# Altium schematic sheet WX0.012.616DL.SchDoc
size A2
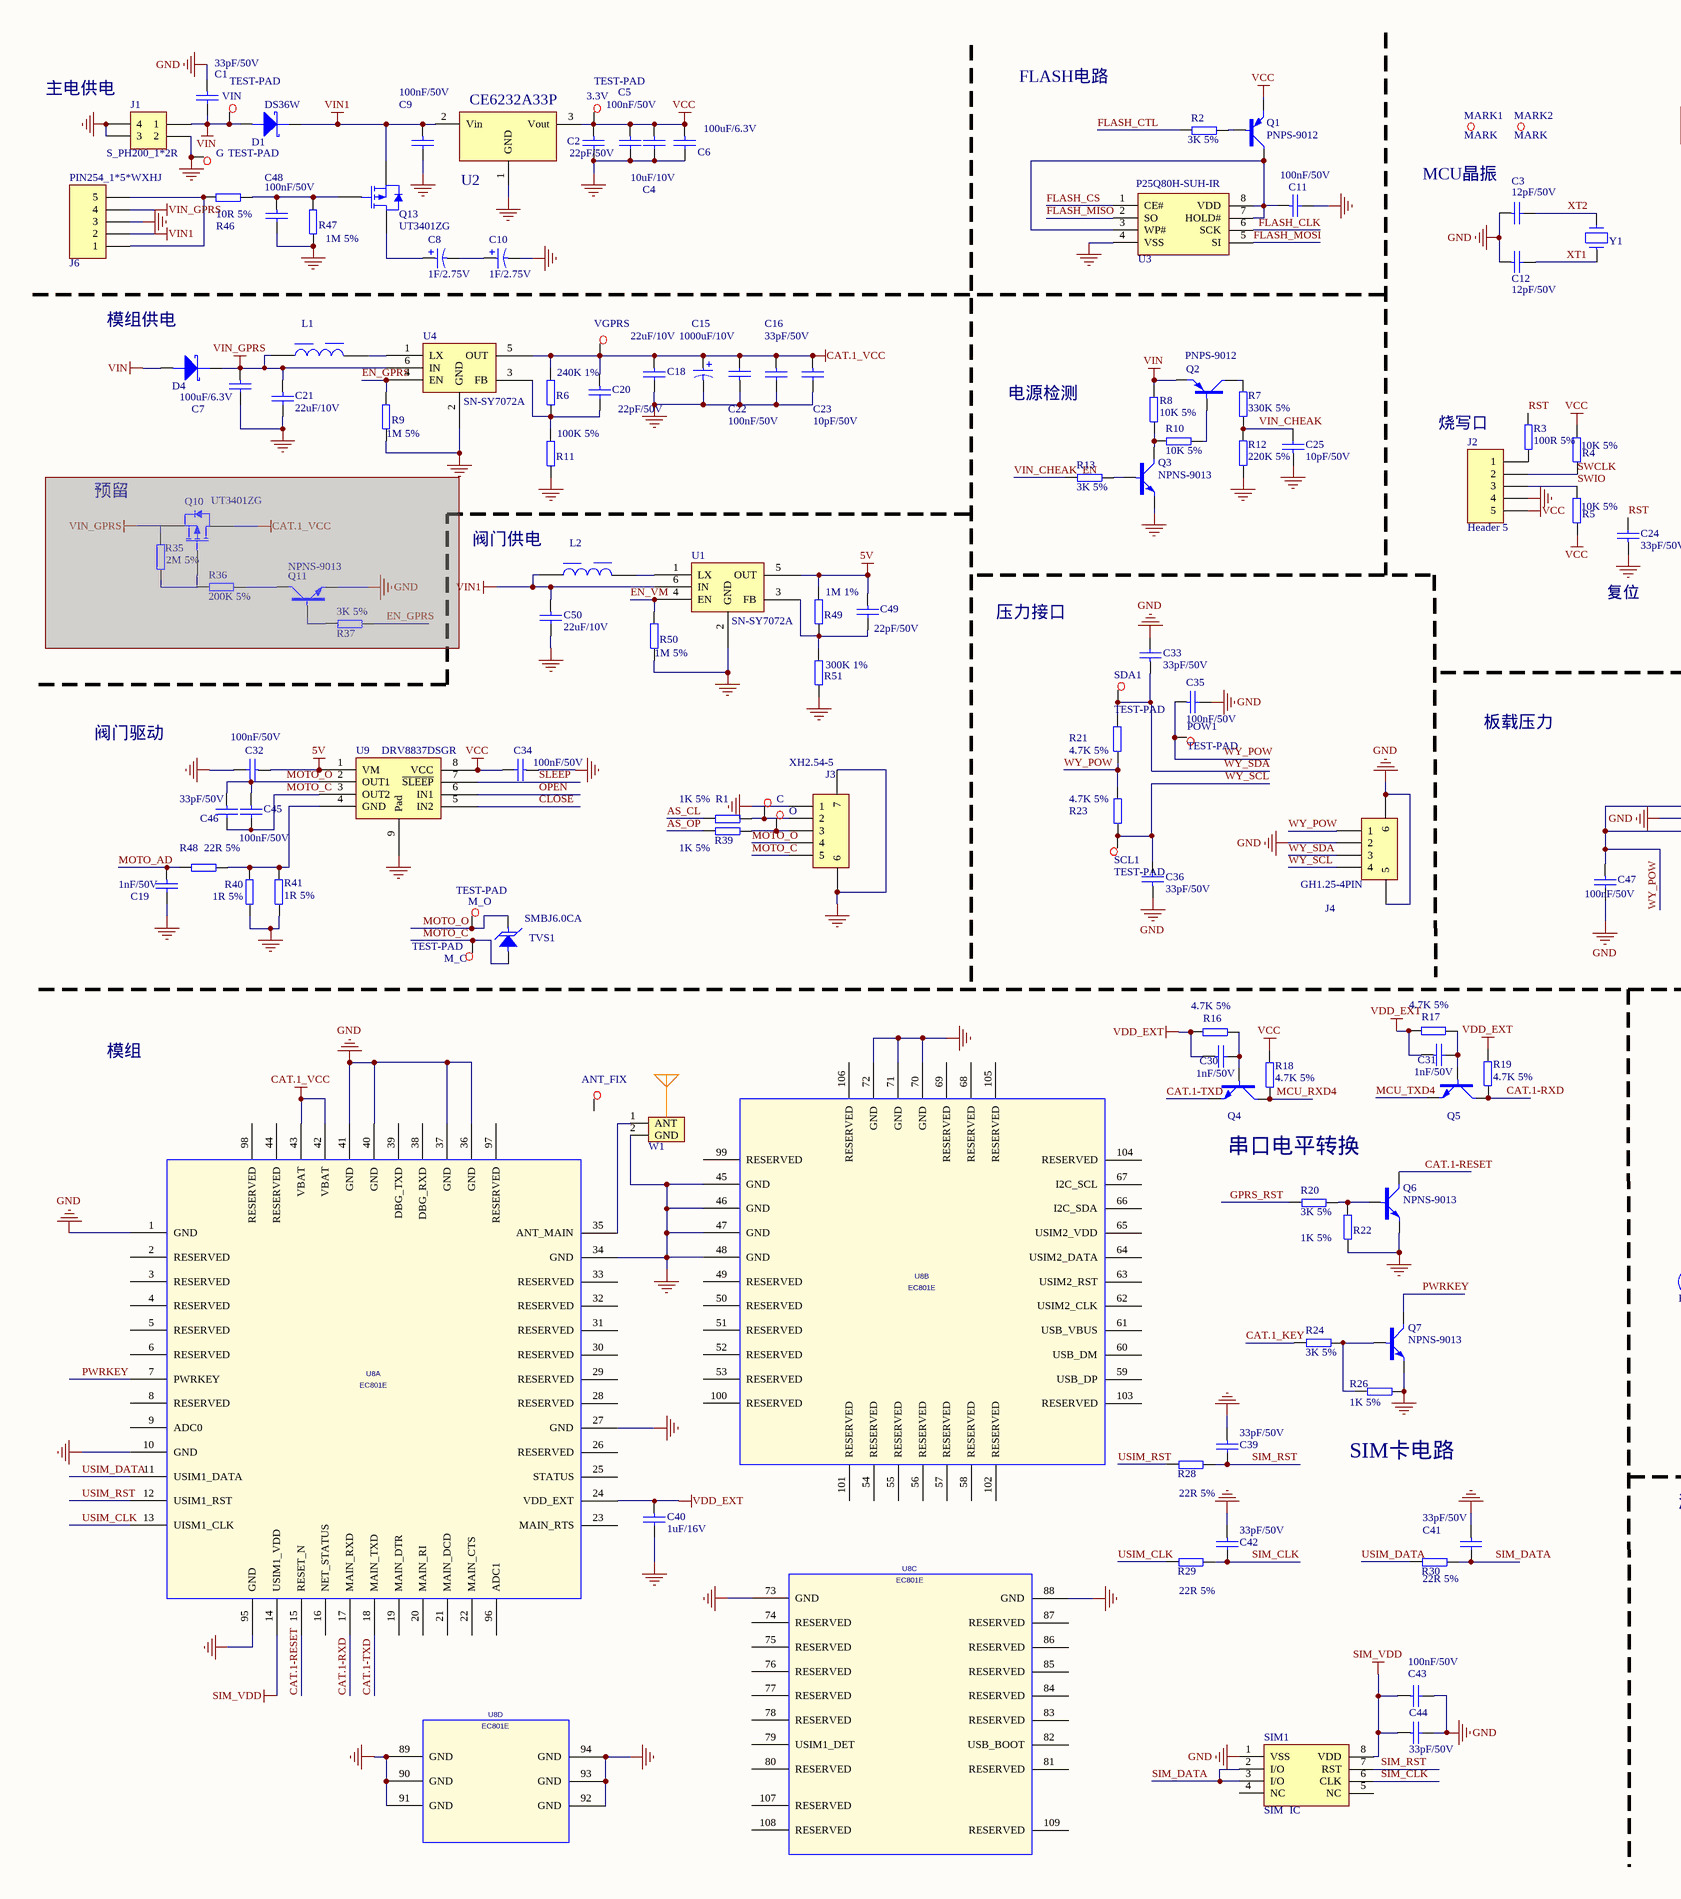
[diagram p0: WX0.012.616DL.SchDoc, left]
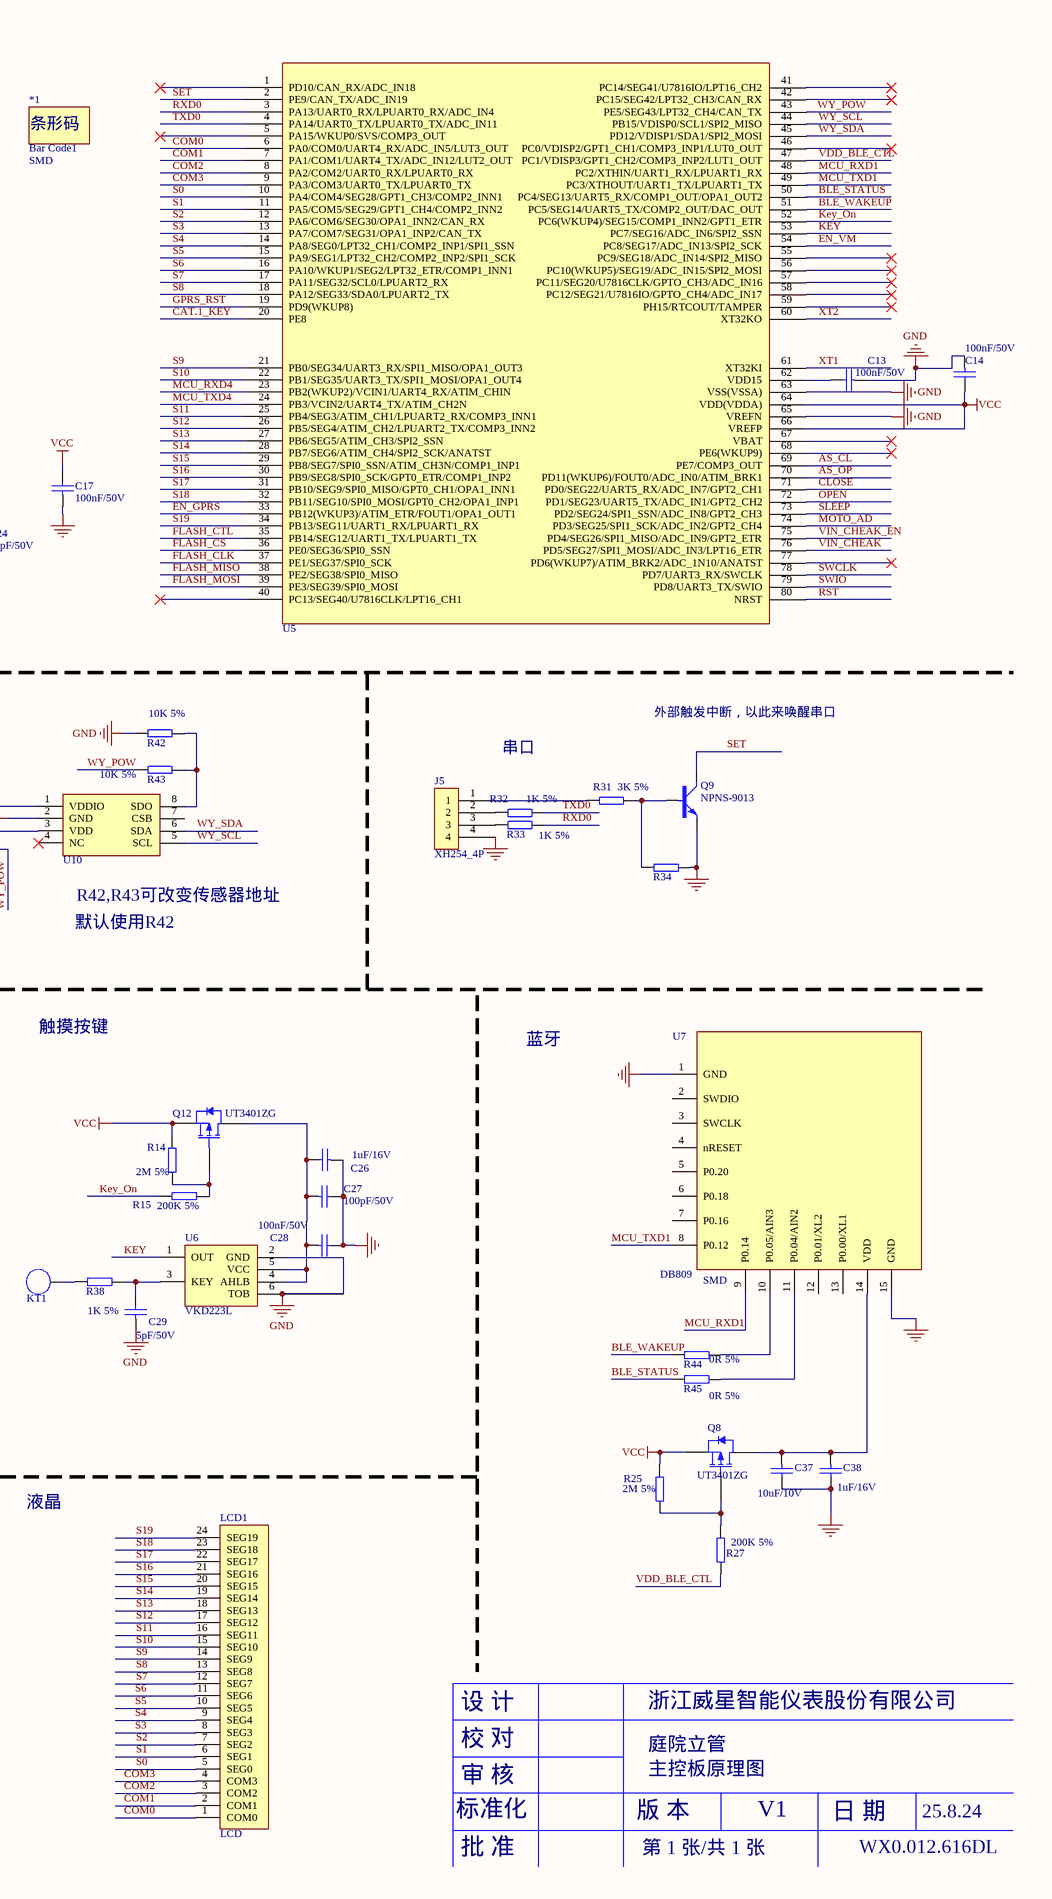
[diagram p1: WX0.012.616DL.SchDoc, right]

## Parts
3.3V  TEST-PAD  [TEST-PAD]
*1  Bar Code1  SMD/DIP: SMD  [Bar Code1]
ANT_FIX  天线固定脚  [ANT-fix]  (value not drawn)
C  TEST-PAD  [TEST-PAD]  (value not drawn)
C1  33pF/50V  [CAP0603]
C2  22pF/50V  [CAP0603]
C3  12pF/50V  [CAP0603]
C4  10uF/10V  [CAP0603]
C5  100nF/50V  [CAP0603]
C6  100uF/6.3V  [GRM1206]
C7  100uF/6.3V  [GRM1206]
C8  1F/2.75V  [CAPPC_350_800_1600]
C9  100nF/50V  [CAP0603]
C10  1F/2.75V  [CAPPC_350_800_1600]
C11  100nF/50V  [CAP0603]
C12  12pF/50V  [CAP0603]
C13  100nF/50V  [CAP0603]
C14  100nF/50V  [CAP0603]
C15  1000uF/10V  [CAPSM_400_1000_1050]
C16  33pF/50V  [CAP0603]
C17  100nF/50V  [CAP0603]
C18  22uF/10V  [CAP0805]
C19  1nF/50V  [CAP0603]
C20  22pF/50V  [CAP0603]
C21  22uF/10V  [CAP0805]
C22  100nF/50V  [CAP0603]
C23  10pF/50V  [CAP0603]
C24  33pF/50V  [CAP0603]
C25  10pF/50V  [CAP0603]
C26  1uF/16V  [CAP0603]
C27  100pF/50V  [CAP0603]
C28  100nF/50V  [CAP0603]
C29  5pF/50V  [CAP0603]
C30  1nF/50V  [CAP0603]
C31  1nF/50V  [CAP0603]
C32  100nF/50V  [CAP0603]
C33  33pF/50V  [CAP0603]
C34  100nF/50V  [CAP0603]
C35  100nF/50V  [CAP0603]
C36  33pF/50V  [CAP0603]
C37  10uF/10V  [CAP0603]
C38  1uF/16V  [CAP0603]
C39  33pF/50V  [CAP0603]
C40  1uF/16V  [CAP0603]
C41  33pF/50V  [CAP0603]
C42  33pF/50V  [CAP0603]
C43  100nF/50V  [CAP0603]
C44  33pF/50V  [CAP0603]
C45  100nF/50V  [CAP0603]
C46  33pF/50V  [CAP0603]
C47  100nF/50V  [CAP0603]
C48  100nF/50V  [CAP0603]
C49  22pF/50V  [CAP0603]
C50  22uF/10V  [CAP0805]
D1  DS36W  [SOD-123FL]
D4  DS36W  [SOD-123FL]  (value not drawn)
G  TEST-PAD  [TEST-PAD]
J1  S_PH200_1*2R  [CONN-SMD_2.0-2PLT]
J2  Header 5  [PIN254_1*5SR]
J3  XH2.54-5  [CONN-SMD_5P-P2.50_ZX-XH2.54-5PLT]
J4  GH1.25-4PIN  [CONN-SMD_4P-P1.25_XUNPU_WAFER-GH1.25-4PLB]
J5  XH254_4P  [HDR1X4_2.54]
J6  PIN254_1*5*WXHJ  [PIN254_1*5*1100S]
KT1  Touch  [TOUCH-0.3-7-8]  (value not drawn)
L1  4.7uH  [IND4020]  (value not drawn)
L2  4.7uH  [IND4020]  (value not drawn)
LCD1  LCD  [GVH31158A-HPP-WG]
M_C  TEST-PAD  [TEST-PAD]
M_O  TEST-PAD  [TEST-PAD]
MARK1  MARK  [MARK]
MARK2  MARK  [MARK]
O  TEST-PAD  [TEST-PAD]  (value not drawn)
POW1  TEST-PAD  [TEST-PAD]
Q1  PNPS-9012  [SOT-23]
Q2  PNPS-9012  [SOT-23]
Q3  NPNS-9013  [SOT-23]
Q4  NPNS-9013  [SOT-23]  (value not drawn)
Q5  NPNS-9013  [SOT-23]  (value not drawn)
Q6  NPNS-9013  [SOT-23]
Q7  NPNS-9013  [SOT-23]
Q8  UT3401ZG  [SOT-23]
Q9  NPNS-9013  [SOT-23]
Q10  UT3401ZG  [SOT-23]  (masked out: inside a compile mask, not in the netlist)
Q11  NPNS-9013  [SOT-23]  (masked out: inside a compile mask, not in the netlist)
Q12  UT3401ZG  [SOT-23]
Q13  UT3401ZG  [SOT-23]
R1  1K 5%  [RES0603]
R2  3K 5%  [RES0603]
R3  100R 5%  [RES0603]
R4  10K 5%  [RES0603]
R5  10K 5%  [RES0603]
R6  240K 1%  [RES0603]
R7  330K 5%  [RES0603]
R8  10K 5%  [RES0603]
R9  1M 5%  [RES0603]
R10  10K 5%  [RES0603]
R11  100K 5%  [RES0603]
R12  220K 5%  [RES0603]
R13  3K 5%  [RES0603]
R14  2M 5%  [RES0603]
R15  200K 5%  [RES0603]
R16  4.7K 5%  [RES0603]
R17  4.7K 5%  [RES0603]
R18  4.7K 5%  [RES0603]
R19  4.7K 5%  [RES0603]
R20  3K 5%  [RES0603]
R21  4.7K 5%  [RES0603]
R22  1K 5%  [RES0603]
R23  4.7K 5%  [RES0603]
R24  3K 5%  [RES0603]
R25  2M 5%  [RES0603]
R26  1K 5%  [RES0603]
R27  200K 5%  [RES0603]
R28  22R 5%  [RES0603]
R29  22R 5%  [RES0603]
R30  22R 5%  [RES0603]
R31  3K 5%  [RES0603]
R32  1K 5%  [RES0603]
R33  1K 5%  [RES0603]
R34  1K 5%  [RES0603]  (value not drawn)
R35  2M 5%  [RES0603]  (masked out: inside a compile mask, not in the netlist)
R36  200K 5%  [RES0603]  (masked out: inside a compile mask, not in the netlist)
R37  3K 5%  [RES0603]  (masked out: inside a compile mask, not in the netlist)
R38  1K 5%  [RES0603]
R39  1K 5%  [RES0603]
R40  1R 5%  [RES1206]
R41  1R 5%  [RES1206]
R42  10K 5%  [RES0603]
R43  10K 5%  [RES0603]
R44  0R 5%  [RES0603]
R45  0R 5%  [RES0603]
R46  10R 5%  [RES0603]
R47  1M 5%  [RES0603]
R48  22R 5%  [RES0603]
R49  1M 1%  [RES0603]
R50  1M 5%  [RES0603]
R51  300K 1%  [RES0603]
SCL1  TEST-PAD  [TEST-PAD]
SDA1  TEST-PAD  [TEST-PAD]
SIM1  SIM  IC  [SIMIC]
TVS1  SMBJ6.0CA  [DO-214AA]
U1  SN-SY7072A  [SOT-23-6]
U2  CE6232A33P  [SOT-89]
U3  P25Q80H-SUH-IR  [SOP-8L-200MIL]
U4  SN-SY7072A  [SOT-23-6]
U5  FM33LG048  [LQFP80]  (value not drawn)
U6  VKD223L  [SOT-23-6]
U7  DB809  SMD/DIP: SMD  [DB809]
U8  EC801E  [EC801E]  (parts A,B,C,D of 4)
U9  DRV8837DSGR  [S-PWSON-N8]
U10  07_HP303B  [HP303B]  (value not drawn)
VGPRS  TEST-PAD  [TEST-PAD]  (value not drawn)
VIN  TEST-PAD  [TEST-PAD]
W1  天线  [ANT-tanpian]  (value not drawn)
Y1  SF32WK32768D71T005  [SMD-3215_2P]  (value not drawn)

## Nets
5V: C32.1 C49.1 R49.2 U1.5(OUT) U9.1(VM)
CAT.1_VCC: C15.1 C16.1 C18.1 C20.1 C22.2 C23.1 R6.2 U4.5(OUT) U8.42(VBAT) U8.43(VBAT) VGPRS.1
GND: C1.1 C2.2 C3.1 C4.2 C5.2 C6.2 C7.2 C9.2 C10.2 C11.2 C12.1 C13.1 C14.1 C15.2 C16.2 C17.1 C18.2 C19.2 C21.2 C22.1 C23.2 C24.1 C25.1 C26.1 C27.2 C28.2 C29.1 C32.2 C33.2 C34.1 C35.2 C36.1 C37.2 C38.2 C39.1 C40.2 C41.1 C42.1 C43.2 C44.2 C47.2 C48.2 C50.2 G.1 J1.2 J1.3 J1.4 J2.4 J3.1 J3.6 J3.7 J4.2 J4.5 J4.6 J5.4 J6.3 Q3.2(E) Q6.2(E) Q7.2(E) Q9.2(E) R9.1 R11.1 R12.2 R22.1 R26.2 R34.2 R40.1 R41.1 R42.2 R47.1 R50.1 R51.1 SIM1.1(VSS) U1.2(GND) U2.1(GND) U3.4(VSS) U4.2(GND) U5.63(VSS(VSSA)) U5.65(VREFN) U6.2(GND) U6.6(TOB) U7.1(GND) U7.15(GND) U8.1(GND) U8.10(GND) U8.27(GND) U8.34(GND) U8.36(GND) U8.37(GND) U8.40(GND) U8.41(GND) U8.45(GND) U8.46(GND) U8.47(GND) U8.48(GND) U8.70(GND) U8.71(GND) U8.72(GND) U8.73(GND) U8.88(GND) U8.89(GND) U8.90(GND) U8.91(GND) U8.92(GND) U8.93(GND) U8.94(GND) U8.95(GND) U9.9(Pad) U10.2(GND) W1.2(GND)
SIM_VDD: C43.1 C44.1 SIM1.8(VDD) U8.14(USIM1_VDD)
VCC: 3.3V.1 C2.1 C4.1 C5.1 C6.1 C14.2 C17.2 C34.2 J2.5 Q1.2(E) Q8.2(S) Q12.2(S) R4.2 R5.1 R14.2 R18.2 R25.2 U2.3(Vout) U5.64(VDD(VDDA)) U5.66(VREFP) U9.8(VCC)
VDD_EXT: C30.1 C31.1 C40.1 R16.1 R17.1 R19.2 U8.24(VDD_EXT)
VIN: C1.2 D1.1 D4.1 J1.1 Q2.2(E) R8.2 VIN.1
VIN1: C9.1 C50.1 D1.2 J6.2 L2.1 Q13.2(S) U1.6(IN) U2.2(Vin)
VIN_GPRS: C7.1 C21.1 D4.2 J6.4 L1.1 U4.6(IN)
AS_CL: R1.1 U5.69(PE7/COMP3_OUT)
AS_OP: R39.1 U5.70(PD11(WKUP6)/FOUT0/ADC_IN0/ATIM_BRK1)
BLE_STATUS: R45.1 U5.50(PC4/SEG13/UART5_RX/COMP1_OUT/OPA1_OUT2)
BLE_WAKEUP: R44.1 U5.51(PC5/SEG14/UART5_TX/COMP2_OUT/DAC_OUT)
CAT.1-RESET: Q6.3(C) U8.15(RESET_N)
CAT.1-RXD: Q5.3(C) R19.1 U8.17(MAIN_RXD)
CAT.1-TXD: Q4.2(E) U8.18(MAIN_TXD)
CAT.1_KEY: R24.1 U5.20(PE8)
CLOSE: U5.71(PD0/SEG22/UART5_RX/ADC_IN7/GPT2_CH1) U9.5(IN2)
COM0: LCD1.1(COM0) U5.6(PA0/COM0/UART4_RX/ADC_IN5/LUT3_OUT)
COM1: LCD1.2(COM1) U5.7(PA1/COM1/UART4_TX/ADC_IN12/LUT2_OUT)
COM2: LCD1.3(COM2) U5.8(PA2/COM2/UART0_RX/LPUART0_RX)
COM3: LCD1.4(COM3) U5.9(PA3/COM3/UART0_TX/LPUART0_TX)
EN_GPRS: R9.2 U4.4(EN) U5.33(PB12(WKUP3)/ATIM_ETR/FOUT1/OPA1_OUT1)
EN_VM: R50.2 U1.4(EN) U5.54(PC8/SEG17/ADC_IN13/SPI2_SCK)
FLASH_CLK: U3.6(SCK) U5.37(PE1/SEG37/SPI0_SCK)
FLASH_CS: U3.1(CE#) U5.36(PE0/SEG36/SPI0_SSN)
FLASH_CTL: R2.1 U5.35(PB14/SEG12/UART1_TX/LPUART1_TX)
FLASH_MISO: U3.2(SO) U5.38(PE2/SEG38/SPI0_MISO)
FLASH_MOSI: U3.5(SI) U5.39(PE3/SEG39/SPI0_MOSI)
GPRS_RST: R20.1 U5.19(PD9(WKUP8))
KEY: U5.53(PC7/SEG16/ADC_IN6/SPI2_SSN) U6.1(OUT)
Key_On: R15.2 U5.52(PC6(WKUP4)/SEG15/COMP1_INN2/GPT1_ETR)
MCU_RXD1: U5.48(PC2/XTHIN/UART1_RX/LPUART1_RX) U7.9(P0.14)
MCU_RXD4: Q4.3(C) R18.1 U5.23(PB2(WKUP2)/VCIN1/UART4_RX/ATIM_CHIN)
MCU_TXD1: U5.49(PC3/XTHOUT/UART1_TX/LPUART1_TX) U7.8(P0.12)
MCU_TXD4: Q5.2(E) U5.24(PB3/VCIN2/UART4_TX/ATIM_CH2N)
MOTO_AD: C19.1 R48.1 U5.74(PD3/SEG25/SPI1_SCK/ADC_IN2/GPT2_CH4)
MOTO_C: C45.2 C46.2 J3.5 M_C.1 TVS1.1 U9.3(OUT2)
MOTO_O: C45.1 C46.1 J3.4 M_O.1 TVS1.2 U9.2(OUT1)
OPEN: U5.72(PD1/SEG23/UART5_TX/ADC_IN1/GPT2_CH2) U9.6(IN1)
PWRKEY: Q7.3(C) U8.7(PWRKEY)
RST: C24.2 R3.1 U5.80(NRST)
RXD0: R33.2 U5.3(PA13/UART0_RX/LPUART0_RX/ADC_IN4)
S0: LCD1.5(SEG0) U5.10(PA4/COM4/SEG28/GPT1_CH3/COMP2_INN1)
S1: LCD1.6(SEG1) U5.11(PA5/COM5/SEG29/GPT1_CH4/COMP2_INN2)
S2: LCD1.7(SEG2) U5.12(PA6/COM6/SEG30/OPA1_INN2/CAN_RX)
S3: LCD1.8(SEG3) U5.13(PA7/COM7/SEG31/OPA1_INP2/CAN_TX)
S4: LCD1.9(SEG4) U5.14(PA8/SEG0/LPT32_CH1/COMP2_INP1/SPI1_SSN)
S5: LCD1.10(SEG5) U5.15(PA9/SEG1/LPT32_CH2/COMP2_INP2/SPI1_SCK)
S6: LCD1.11(SEG6) U5.16(PA10/WKUP1/SEG2/LPT32_ETR/COMP1_INN1)
S7: LCD1.12(SEG7) U5.17(PA11/SEG32/SCL0/LPUART2_RX)
S8: LCD1.13(SEG8) U5.18(PA12/SEG33/SDA0/LPUART2_TX)
S9: LCD1.14(SEG9) U5.21(PB0/SEG34/UART3_RX/SPI1_MISO/OPA1_OUT3)
S10: LCD1.15(SEG10) U5.22(PB1/SEG35/UART3_TX/SPI1_MOSI/OPA1_OUT4)
S11: LCD1.16(SEG11) U5.25(PB4/SEG3/ATIM_CH1/LPUART2_RX/COMP3_INN1)
S12: LCD1.17(SEG12) U5.26(PB5/SEG4/ATIM_CH2/LPUART2_TX/COMP3_INN2)
S13: LCD1.18(SEG13) U5.27(PB6/SEG5/ATIM_CH3/SPI2_SSN)
S14: LCD1.19(SEG14) U5.28(PB7/SEG6/ATIM_CH4/SPI2_SCK/ANATST)
S15: LCD1.20(SEG15) U5.29(PB8/SEG7/SPI0_SSN/ATIM_CH3N/COMP1_INP1)
S16: LCD1.21(SEG16) U5.30(PB9/SEG8/SPI0_SCK/GPT0_ETR/COMP1_INP2)
S17: LCD1.22(SEG17) U5.31(PB10/SEG9/SPI0_MISO/GPT0_CH1/OPA1_INN1)
S18: LCD1.23(SEG18) U5.32(PB11/SEG10/SPI0_MOSI/GPT0_CH2/OPA1_INP1)
S19: LCD1.24(SEG19) U5.34(PB13/SEG11/UART1_RX/LPUART1_RX)
SET: Q9.3(C) U5.2(PE9/CAN_TX/ADC_IN19)
SIM_CLK: C42.2 R29.2 SIM1.6(CLK)
SIM_DATA: C41.2 R30.2 SIM1.2(I/O) SIM1.3(I/O)
SIM_RST: C39.2 R28.2 SIM1.7(RST)
SLEEP: U5.73(PD2/SEG24/SPI1_SSN/ADC_IN8/GPT2_CH3) U9.7(~{SLEEP})
SWCLK: J2.2 R4.1 U5.78(PD7/UART3_RX/SWCLK)
SWIO: J2.3 R5.2 U5.79(PD8/UART3_TX/SWIO)
TXD0: R32.2 U5.4(PA14/UART0_TX/LPUART0_TX/ADC_IN11)
USIM_CLK: R29.1 U8.13(UISM1_CLK)
USIM_DATA: R30.1 U8.11(USIM1_DATA)
USIM_RST: R28.1 U8.12(USIM1_RST)
VDD_BLE_CTL: R27.1 U5.47(PC1/VDISP3/GPT1_CH2/COMP3_INP2/LUT1_OUT)
VIN_CHEAK: C25.2 R7.2 R12.1 U5.76(PD5/SEG27/SPI1_MOSI/ADC_IN3/LPT16_ETR)
VIN_CHEAK_EN: R13.1 U5.75(PD4/SEG26/SPI1_MISO/ADC_IN9/GPT2_ETR)
WY_POW: C35.1 C47.1 J4.1 POW1.1 R21.1 R23.1 R43.2 U5.43(PE5/SEG43/LPT32_CH4/CAN_TX) U10.1(VDDIO) U10.3(VDD)
WY_SCL: C36.2 J4.4 R23.2 SCL1.1 U5.44(PB15/VDISP0/SCL1/SPI2_MISO) U10.5(SCL)
WY_SDA: C33.1 J4.3 R21.2 SDA1.1 U5.45(PD12/VDISP1/SDA1/SPI2_MOSI) U10.6(SDA)
XT1: C12.2 U5.61(XT32KI) Y1.1
XT2: C3.2 U5.60(XT32KO) Y1.2
NetC8_1: C8.1 Q13.3(D)
NetC8_2: C8.2 C10.1
NetC11_1: C11.1 Q1.3(C) U3.3(WP#) U3.7(HOLD#) U3.8(VDD)
NetC13_2: C13.2 U5.62(VDD15)
NetC20_2: C20.2 R6.1 R11.2 U4.3(FB)
NetC26_2: C26.2 C27.1 C28.1 Q12.3(D) U6.4(AHLB) U6.5(VCC)
NetC29_2: C29.2 R38.2 U6.3(KEY)
NetC30_2: C30.2 Q4.1(B) R16.2
NetC31_2: C31.2 Q5.1(B) R17.2
NetC37_1: C37.1 C38.1 Q8.3(D) U7.14(VDD)
NetC48_1: C48.1 Q13.1(G) R46.2 R47.2
NetC49_2: C49.2 R49.1 R51.2 U1.3(FB)
NetC_1: C.1 J3.2 R1.2
NetJ2_1: J2.1 R3.2
NetJ3_3: J3.3 O.1 R39.2
NetJ5_1: J5.1 R31.1
NetJ5_2: J5.2 R32.1
NetJ5_3: J5.3 R33.1
NetJ6_1: J6.1 J6.5 R46.1
NetKT1_1: KT1.1 R38.1
NetL1_2: L1.2 U4.1(LX)
NetL2_2: L2.2 U1.1(LX)
NetQ1_1: Q1.1(B) R2.2
NetQ2_1: Q2.1(B) R10.2
NetQ2_3: Q2.3(C) R7.1
NetQ3_1: Q3.1(B) R13.2
NetQ3_3: Q3.3(C) R8.1 R10.1
NetQ6_1: Q6.1(B) R20.2 R22.2
NetQ7_1: Q7.1(B) R24.2 R26.1
NetQ8_1: Q8.1(G) R25.1 R27.2
NetQ9_1: Q9.1(B) R31.2 R34.1
NetQ12_1: Q12.1(G) R14.1 R15.1
NetR40_2: R40.2 R41.2 R48.2 U9.4(GND)
NetR42_1: R42.1 R43.1 U10.8(SDO)
NetR44_2: R44.2 U7.10(P0.05/AIN3)
NetR45_2: R45.2 U7.11(P0.04/AIN2)
NetU8_35: U8.35(ANT_MAIN) W1.1(ANT)

Not connected (* = marked no-connect by the designer): ANT_FIX 1; SIM1 4(NC) 5(NC); U5 1(PD10/CAN_RX/ADC_IN18)* 5(PA15/WKUP0/SVS/COMP3_OUT)* 40(PC13/SEG40/U7816CLK/LPT16_CH1)* 41(PC14/SEG41/U7816IO/LPT16_CH2)* 42(PC15/SEG42/LPT32_CH3/CAN_RX)* 46(PC0/VDISP2/GPT1_CH1/COMP3_INP1/LUT0_OUT)* 55(PC9/SEG18/ADC_IN14/SPI2_MISO)* 56(PC10(WKUP5)/SEG19/ADC_IN15/SPI2_MOSI)* 57(PC11/SEG20/U7816CLK/GPTO_CH3/ADC_IN16)* 58(PC12/SEG21/U7816IO/GPTO_CH4/ADC_IN17)* 59(PH15/RTCOUT/TAMPER)* 67(VBAT)* 68(PE6(WKUP9))* 77(PD6(WKUP7)/ATIM_BRK2/ADC_1N10/ANATST)*; U7 2(SWDIO) 3(SWCLK) 4(nRESET) 5(P0.20) 6(P0.18) 7(P0.16) 12(P0.01/XL2) 13(P0.00/XL1); U8 2(RESERVED) 3(RESERVED) 4(RESERVED) 5(RESERVED) 6(RESERVED) 8(RESERVED) 9(ADC0) 16(NET_STATUS) 19(MAIN_DTR) 20(MAIN_RI) 21(MAIN_DCD) 22(MAIN_CTS) 23(MAIN_RTS) 25(STATUS) 26(RESERVED) 28(RESERVED) 29(RESERVED) 30(RESERVED) 31(RESERVED) 32(RESERVED) 33(RESERVED) 38(DBG_RXD) 39(DBG_TXD) 44(RESERVED) 49(RESERVED) 50(RESERVED) 51(RESERVED) 52(RESERVED) 53(RESERVED) 54(RESERVED) 55(RESERVED) 56(RESERVED) 57(RESERVED) 58(RESERVED) 59(USB_DP) 60(USB_DM) 61(USB_VBUS) 62(USIM2_CLK) 63(USIM2_RST) 64(USIM2_DATA) 65(USIM2_VDD) 66(I2C_SDA) 67(I2C_SCL) 68(RESERVED) 69(RESERVED) 74(RESERVED) 75(RESERVED) 76(RESERVED) 77(RESERVED) 78(RESERVED) 79(USIM1_DET) 80(RESERVED) 81(RESERVED) 82(USB_BOOT) 83(RESERVED) 84(RESERVED) 85(RESERVED) 86(RESERVED) 87(RESERVED) 96(ADC1) 97(RESERVED) 98(RESERVED) 99(RESERVED) 100(RESERVED) 101(RESERVED) 102(RESERVED) 103(RESERVED) 104(RESERVED) 105(RESERVED) 106(RESERVED) 107(RESERVED) 108(RESERVED) 109(RESERVED); U10 4(NC)* 7(CSB)

## Notes on the sheet
- 主电供电
- FLASH电路
- MCU晶振
- 模组供电
- 电源检测
- 烧写口
- 预留
- 阀门供电
- (near C24) 复位
- 压力接口
- 外部触发中断，以此来唤醒串口
- 阀门驱动
- 板载压力
- 串口
- (near U10) R42,R43可改变传感器地址
- 默认使用R42
- 模组
- 触摸按键
- 蓝牙
- 串口电平转换
- SIM卡电路
- 液晶
- 设 计
- 校 对
- 浙江威星智能仪表股份有限公司
- 庭院立管
- 标准化
- 审 核
- 主控板原理图
- V1
- 25.8.24
- 批 准
- 版 本
- 第 1 张/共 1 张
- 日 期
- WX0.012.616DL

## Library data of the parts
3.3V C G M_C M_O O POW1 SCL1 SDA1 VGPRS VIN = AD_WXHJ_TEST-PAD_01: 单面焊盘测试点; Part Name: 测试点; ID: 23; SMD/DIP: SMD; Part Number: AD_WXHJ_TEST-PAD_01
*1 = AD_WXHJ_Bar Code_02: 条形码 ,填充，无需焊接器件; ID: 17; Part Number: AD_WXHJ_Bar Code_02; Part Name: 条形码
ANT_FIX = AD_WXHJ_TEST-POINT_01: ID: 24; SMD/DIP: SMD; Part Number: AD_WXHJ_TEST-POINT_01; Part Name: 天线固定脚
C1 C16 C24 C33 C36 C39 C41 C42 C44 C46 = 101020103-0027: 33pF,50 V,±10%,0603,国巨,CC0603KRNPO9BN33; Part Name: 0603贴片电容; ID: 17; SMD/DIP: SMD; Part Number: 101020103-0027
C2 C20 C49 = 101020103-0009: 22pF,50 V,±5%,0603,国巨,CC0603JRNPO9BN22; Part Name: 0603贴片电容; ID: 16; SMD/DIP: SMD; Part Number: 101020103-0009
C3 C12 = 101020103-0005: 12P,50 V,±5%,0603,国巨,CC0603JRNPO9BN12; Part Name: 0603贴片电容; ID: 11; SMD/DIP: SMD; Part Number: 101020103-0005
C4 C37 = 101020103-0026: 106pF,10 V,±10%,0603,村田,GRM188R61A106KE47D; Part Name: 0603贴片电容; ID: 8; SMD/DIP: SMD; Part Number: 101020103-0026
C5 C9 C11 C13 C14 C17 C22 C28 C32 C34 C35 C43 C45 C47 C48 = 101020103-0021: 104pF,50 V,±10%,0603,国巨,CC0603KRX7R9BB104; Part Name: 0603贴片电容; ID: 3; SMD/DIP: SMD; Part Number: 101020103-0021
C6 C7 = 101020101-0020: 100uF,6.3 V,±20%,1206,村田,GRM31CR60J107ME39L; Part Name: 贴片电容; ID: 27; SMD/DIP: SMD; Part Number: 101020101-0020
C8 C10 = 1010202-0015: 1F,2.75 V,-20%~+20%,8mm*16mm,红宝石,2.7 DMC 1 M MY4 8X16; Part Name: 法拉电容; ID: 12; SMD/DIP: DIP; Part Number: 1010202-0015
C15 = 1010203-0033: 1000UF,10 V,±20%,10*10.5mm,广东风华高新技术股份有限公司,8102LBM010MT0001T; Part Name: 贴片电解电容; ID: 24; SMD/DIP: SMD; Part Number: 1010203-0033
C18 C21 C50 = 101020102-0012: 226P,10 V,±20%,0805,村田电子有限公司,GRM21BR61A226ME51L; Part Name: 贴片电容; ID: 20; SMD/DIP: SMD; Part Number: 101020102-0012
C19 C30 C31 = 101020103-0022: 102pF,50 V,±10%,0603,国巨,CC0603KRX7R9BB102; Part Name: 0603贴片电容; ID: 13; SMD/DIP: SMD; Part Number: 101020103-0022
C23 C25 = 101020103-0014: 10pF,50 V,±5%,0603,X7R,国巨,CC0603JRNPO9BN100; Part Name: 0603贴片电容; ID: 7; SMD/DIP: SMD; Part Number: 101020103-0014
C26 C38 C40 = 101020103-0003: 105pF,16 V,±10%,0603,国巨,CC0603KRX7R7BB105; Part Name: 0603贴片电容; ID: 14; SMD/DIP: SMD; Part Number: 101020103-0003
C27 = 101020103-0010: 101pf,50 V,±5%,0603,国巨,CC0603JRNP09BN101; Part Name: 0603贴片电容; ID: 4; SMD/DIP: SMD; Part Number: 101020103-0010
C29 = 101020103-0028: 5P,50 V,±5%,0603,闵达,5P/50V，±5%，0603; Part Name: 0603贴片电容; ID: 28; SMD/DIP: SMD; Part Number: 101020103-0028
D1 D4 = 101040101-0055: DS36W,SOD123-FL,3 A,42 V,60 V,浙江领晨科技有限公司,DS36W; Part Name: 贴片肖特基; ID: 40; SMD/DIP: SMD; Part Number: 101040101-0055
J1 = 1010902-0125: PH2.0_2AWR 卧,贴片卧式,母头,单排,2针2.0mm; Part Name: PH座; ID: 24; SMD/DIP: SMD; Part Number: 1010902-0125
J2 = Header 5: Header, 5-Pin
J4 = GH1.25-4PIN: GH1.25-4PIN,立贴
J5 = 90003: 单排插针，4PIN,间距2.54mm; Part Number: 90003; Part Name: 单排插针; ID: 12
J6 = AD_WXHJ_PinHeader_02: 1*5 ，Φ1.0 ，2.54mm，直脚,无需焊接器件; Part Name: 排针; ID: 17; SMD/DIP: DIP; Part Number: AD_WXHJ_PinHeader_02
KT1 = 2: 长度>6，直径9mm; Part Name: 按键; ID: 2; Part Number: *
L1 L2 = 1010302-0027: 4.7uH,2.9A,±20%,4020,伍尔特电子有限公司,74438356047; Part Name: 贴片电感; ID: 43; SMD/DIP: SMD; Part Number: 1010302-0027
LCD1 = GVH31158A
MARK1 MARK2 = AD_WXHJ_MARK_01: MARK点; ID: 8; SMD/DIP: SMD; Part Number: AD_WXHJ_MARK_01; Part Name: MARK点
Q1 Q2 = 101040201-0001: 9012,PNP,SOT-23,JCET;长电,S9012; Part Name: 贴片三极管; ID: 16; SMD/DIP: SMD; Part Number: 101040201-0001
Q3 Q6 Q7 Q9 = 101040201-0002: 9013,NPN,SOT-23,长电,S9013; Part Name: 贴片三极管; ID: 14; SMD/DIP: SMD; Part Number: 101040201-0002
Q4 Q5 Q11 = 101040201-0002: 9013,NPN,SOT-23,长电,S9013; Part Name: 贴片三极管; ID: 15; SMD/DIP: SMD; Part Number: 101040201-0002
Q8 Q10 Q12 Q13 = 101040201-0013: UT3401ZG,P-MOS,SOT-23,UTC,UT3401ZG; Part Name: 功率MOS管; ID: 18; SMD/DIP: SMD; Part Number: 101040201-0013
R1 R22 R26 R32-R34 R38 R39 = 101010103-0008: 1K,±5%,1/10W,0603,国巨,RC0603JR-071KL; Part Name: 0603贴片电阻; ID: 10; SMD/DIP: SMD; Part Number: 101010103-0008
R2 R20 = 101010103-0006: 国巨,±5%,0603,,155 ℃,-55 ℃,RC0603JR-073KL,无铅,100 ppm/℃,1/10W,,3K; Part Name: 0603贴片电阻; ID: 22; SMD/DIP: SMD; Part Number: 101010103-0006
R3 = 101010103-0022: 100R,±5%,1/10W,0603,国巨,RC0603JR-07100RL; Part Name: 0603贴片电阻; ID: 5; SMD/DIP: SMD; Part Number: 101010103-0022
R4 R5 R8 R10 R42 R43 = 101010103-0003: 国巨,±5%,0603,,155 ℃,-55 ℃,RC0603JR-0710KL,无铅,200 ppm/℃,1/10W,,10K; Part Name: 0603贴片电阻; ID: 7; SMD/DIP: SMD; Part Number: 101010103-0003
R6 R11 = 101010103-0005: 国巨,±5%,0603,,155 ℃,-55 ℃,RC0603JR-07100KL,无铅,100 ppm/℃,1/10W,,100K; Part Name: 0603贴片电阻; ID: 3; SMD/DIP: SMD; Part Number: 101010103-0005
R7 = 101010103-0066: 330K,±5%,1/10W,0603,国巨,RC0603JR-07330KL; Part Name: 0603贴片电阻; ID: 30; SMD/DIP: SMD; Part Number: 101010103-0066
R9 R47 R50 = 101010103-0002: 国巨,±5%,0603,,155 ℃,-55 ℃,RC0603JR-071ML,无铅,200 ppm/℃,1/10W,,1M; Part Name: 0603贴片电阻; ID: 11; SMD/DIP: SMD; Part Number: 101010103-0002
R12 = 101010103-0044: 220K,±5%,1/10W,0603,国巨,RC0603JR-07220KL; Part Name: 0603贴片电阻; ID: 31; SMD/DIP: SMD; Part Number: 101010103-0044
R13 R37 = 101010103-0006: 国巨,±5%,0603,,155 ℃,-55 ℃,RC0603JR-073KL,无铅,100 ppm/℃,1/10W,,3K; Part Name: 0603贴片电阻; ID: 23; SMD/DIP: SMD; Part Number: 101010103-0006
R14 R25 R35 = 101010103-0025: 国巨,±5%,0603,,155 ℃,-55 ℃,RC0603JR-072ML,含铅,100 ppm/℃,1/10W,,2M; Part Name: 0603贴片电阻; ID: 20; SMD/DIP: SMD; Part Number: 101010103-0025
R15 R27 R36 = 101010103-0034: 200K,±5%,1/10W,0603,国巨,RC0603JR-07200KL; Part Name: 0603贴片电阻; ID: 13; SMD/DIP: SMD; Part Number: 101010103-0034
R16-R19 R21 R23 = 101010103-0042: 4.7K±5%,1/10W,0603; Part Name: 0603贴片电阻; ID: 24; SMD/DIP: SMD; Part Number: 101010103-0042
R24 R31 = 101010103-0006: 3K±5%,1/10W,0603; Part Name: 0603贴片电阻; ID: 56; Part Number: 101010103-0006
R28-R30 R48 = 101010103-0009: 国巨,±5%,0603,,155 ℃,-55 ℃,RC0603JR-0722RL,无铅,200 ppm/℃,1/10W,,22欧; Part Name: 0603贴片电阻; ID: 18; SMD/DIP: SMD; Part Number: 101010103-0009
R40 R41 = 101010101-0015: 1R±5%,1/4W,1206; Part Name: 1206贴片电阻; ID: 115; Part Number: 101010101-0015
R44 R45 = 101010103-0001: 国巨,±5%,0603,,155 ℃,-55 ℃,RC0603J2-070RL,无铅,200 ppm/℃,1/10W,,0R; Part Name: 0603贴片电阻; ID: 1; SMD/DIP: SMD; Part Number: 101010103-0001
R46 = 101010103-0017: 10R,±5%,1/10W,0603,国巨,RC0603JR-0710RL; Part Name: 0603贴片电阻; ID: 8; SMD/DIP: SMD; Part Number: 101010103-0017
R49 = 101010103-0040: 国巨,±1%,0603,,155 ℃,-55 ℃,RC0603FR-071ML,无铅,100 ppm/℃,1/10W,,1M; Part Name: 0603贴片电阻; ID: 36; SMD/DIP: SMD; Part Number: 101010103-0040
R51 = 101010103-0078: 300K,±1%,1/10W,0603,国巨股份有限公司,RC0603FR-07300KL; Part Name: 0603贴片电阻; ID: 37; SMD/DIP: SMD; Part Number: 101010103-0078
SIM1 = SIMCARD_1
TVS1 = 101040101-0024: SMBJ6.0CA,DO-214AA,10.3 V,6.0 V,600 W,58.3 A,800 uA,上海君耀电子有限公司,SMBJ6.0CA; Part Name: TVS管; ID: 23; SMD/DIP: SMD; Part Number: 101040101-0024
U1 U4 = 1010503-0023: SN-SY7072A,SN-SY7072A,SOT23-6,5.5 V,0.85 V,-0.95 V,5 V,2A,5 uA,矽力杰股份有限公司; Part Name: 贴片芯片; ID: 32; SMD/DIP: SMD; Part Number: 1010503-0023
U2 = 1010503-0029: CE6232-3.3,CE6232-3.3,SOT89-3,8V,1.8V,0.11V,3.3V,300mA,0.8uA,南京芯力微电子有限公司; Part Name: 线性稳压芯片; ID: 5; SMD/DIP: SMD; Part Number: 1010503-0029
U3 = 101050101-0218: P25Q80H-SUH-IR,SOP8208mil,普冉半导体（上海）股份有限公司,P25Q80H-SUH-IR; Part Name: 贴片存储芯片FLASH; ID: 35; SMD/DIP: SMD; Part Number: 101050101-0218
U5 = 101050101-0261: 1.65V-5.5V,LQFP80,上海复旦微电子集团股份有限公司,FM33LG048; Part Name: MCU处理器; ID: 42; SMD/DIP: SMD; Part Number: 101050101-0261
U7 = 1011402-0194: 北高智蓝牙模块DB809; Part Name: 蓝牙模块; ID: 15; Part Number: 1011402-0194
U8 = EC801E: EC801E Moudle 109PIN 17.7X15.8mm H2.4mm RO; Manufacturer: QUECTEL; Geometry.Height: 2.4mm; Part Description: EC801E Moudle 109PIN 17.7X15.8mm H2.4mm RO; Value: EC801E
U9 = 101050101-0060: DRV8837DSGR,S-PWSON-N8,TI,DRV8837DSGR; Part Name: 驱动芯片; ID: 23; SMD/DIP: SMD; Part Number: 101050101-0060
U10 = 1011301-0022: HP303B,4.7mm*3.7mm,惠贻华普,HP303B,含铅; Part Name: HP303B温压传感器; ID: 27; SMD/DIP: SMD; Part Number: 1011301-0022
W1 = 1010902-0145: UB06000058A,3*3.1*1.25mm,公头,单排,IPEX一代板端; Part Name: IPEX座; ID: 31; SMD/DIP: SMD; Part Number: 1010902-0145
Y1 = 1010601-0020: SF32WK32768D71T005,3215,32.768kHz,-0.03 ppm/℃,无源,湖北泰晶电子科技股份有限公司,SF32WK32768D71T005; Part Name: 贴片晶振; ID: 45; SMD/DIP: SMD; Part Number: 1010601-0020